# Altium schematic sheet 5V_Power_Supply.SchDoc
size B; Author: AM; CompanyName: Expatria Technologies; DrawnBy: A.Marles; Engineer: AM; Organization: Expatria Technologies; DocumentNumber: 4; Revision: A1; SheetNumber: 4; SheetTotal: 14; PCB_Rev: A1
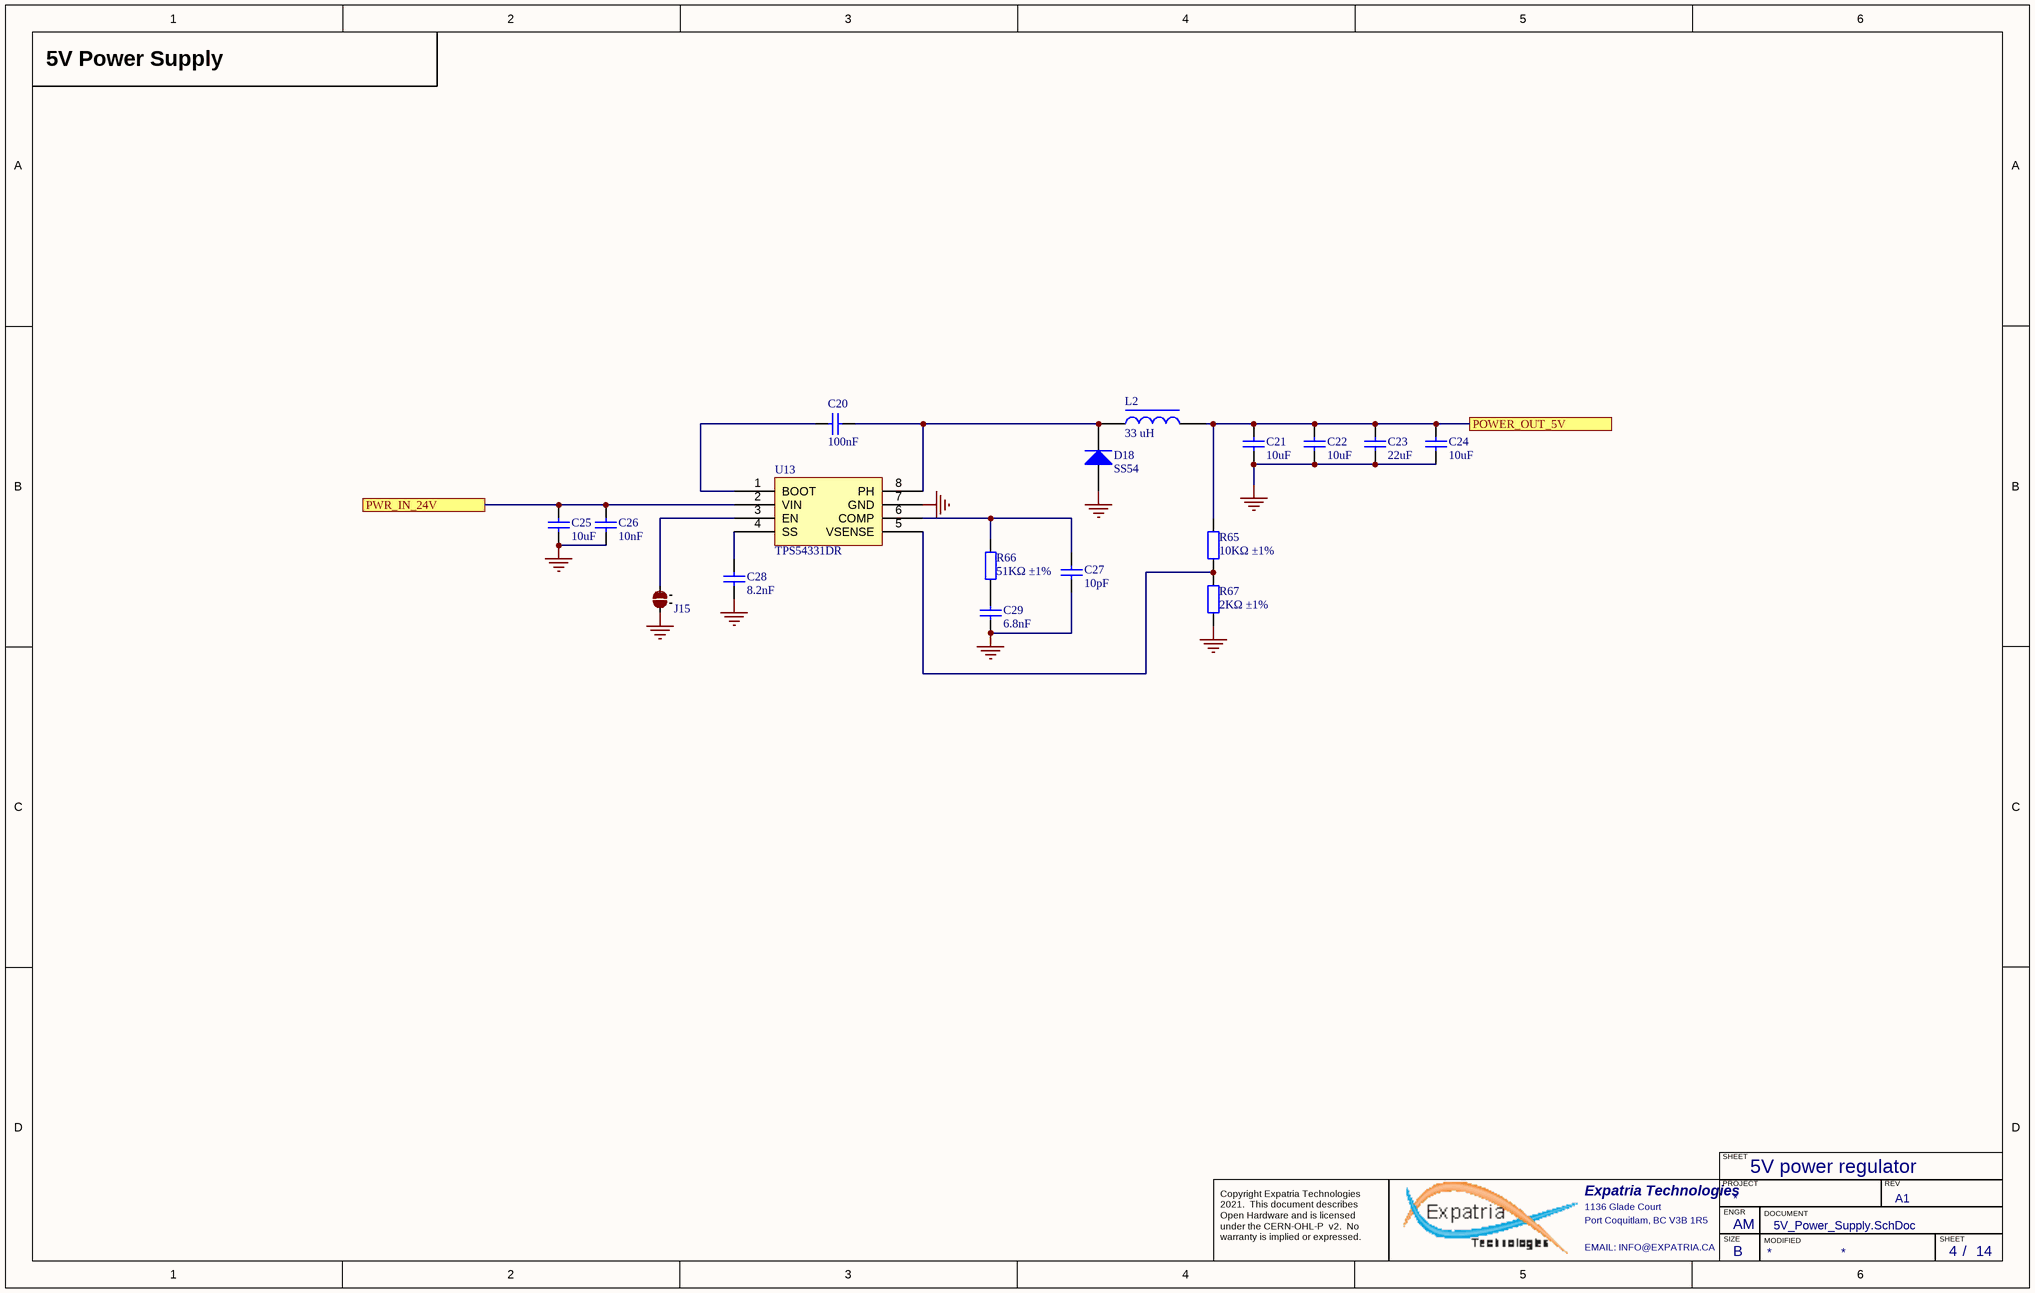
[diagram p0: 5V_Power_Supply.SchDoc]

## Parts
C20  100nF  [0603_C]
C21  10uF  [0603_C]
C22  10uF  [0603_C]
C23  22uF  [0805_C]
C24  10uF  [0603_C]
C25  10uF  [1206_C]
C26  10nF  [0402_C]
C27  10pF  [0402_C]
C28  8.2nF  [0603_C]
C29  6.8nF  [0402_C]
D18  SS54  [SMA(DO-214AC)_S1]
J15  2 way net solder junction - Normally Open  [2waySolder_NO]  (value not drawn)  (no BOM)
L2  33 uH  [INDPM7366X300N]
R65  10KΩ ±1%  [0402_R]
R66  51KΩ ±1%  [0402_R]
R67  2KΩ ±1%  [0402_R]
U13  TPS54331DR  [SOIC-8_150mil]

## Ports
POWER_OUT_5V, PWR_IN_24V

## Nets
GND: C21.1 C22.1 C23.1 C24.1 C25.1 C26.1 C27.1 C28.1 C29.1 D18.1(A) J15.1 R67.1 U13.7(GND)
POWER_OUT_5V: C21.2 C22.2 C23.2 C24.2 L2.2 R65.2 ; port POWER_OUT_5V
PWR_IN_24V: C25.2 C26.2 U13.2(VIN) ; port PWR_IN_24V
NetC20_1: C20.1 U13.1(BOOT)
NetC20_2: C20.2 D18.2(K) L2.1 U13.8(PH)
NetC27_2: C27.2 R66.2 U13.6(COMP)
NetC28_2: C28.2 U13.4(SS)
NetC29_2: C29.2 R66.1
NetJ15_2: J15.2 U13.3(EN)
NetR65_1: R65.1 R67.2 U13.5(VSENSE)

## Notes on the sheet
- 5V Power Supply
- 5V power regulator
- SHEET
- Expatria Technologies
- 1136 Glade Court
- Port Coquitlam, BC V3B 1R5
- PROJECT
- SIZE
- ENGR
- MODIFIED
- DOCUMENT
- REV
- Copyright Expatria Technologies 2021.  This document describes Open Hardware and is licensed under the CERN-OHL-P  v2.  No warranty is implied or expressed.
- EMAIL: INFO@EXPATRIA.CA
- B
- /

## Library data of the parts
C20 = 0603 100nF (104) 10% 50V: Chip capacitors; Manufacturer: YAGEO; PartNumber: CC0603KRX7R9BB104; Tolerance: 10%; Voltage: 50V; Package: 0603; Supplier: LC; SuppliersPartNumber: C14663; Capacitance: 100nF
C21 C22 C24 = 0603 10uF (106) 10% 10V: Chip capacitors; Manufacturer: Samsung Electro-Mechanics; PartNumber: CL10A106KP8NNNC; Tolerance: 10%; Voltage: 10V; Package: 0603; Supplier: LC; SuppliersPartNumber: C19702; Capacitance: 10uF
C23 = 0805 22uF (226) 20% 25V: Chip capacitors; Manufacturer: Samsung Electro-Mechanics; PartNumber: CL21A226MAQNNNE; Tolerance: 20%; Voltage: 25V; Package: 0805; Supplier: LC; SuppliersPartNumber: C45783; Capacitance: 22uF
C25 = 1206 10uF (106) 10% 50V: Chip capacitors; Manufacturer: Samsung Electro-Mechanics; PartNumber: CL31A106KBHNNNE; Tolerance: 10%; Voltage: 50V; Package: 1206; Supplier: LC; SuppliersPartNumber: C13585; Capacitance: 10uF
C26 = 0402 10nF (103) 10% 50V: Chip capacitors; Manufacturer: Samsung Electro-Mechanics; PartNumber: CL05B103KB5NNNC; Tolerance: 10%; Voltage: 50V; Package: 0402; Supplier: LC; SuppliersPartNumber: C15195; Capacitance: 10nF
C27 = 0402 10pF (100) 5% 50V: Chip capacitors; Manufacturer: Samsung Electro-Mechanics; PartNumber: CL05C100JB5NNNC; Tolerance: 5%; Voltage: 50V; Package: 0402; Supplier: LC; SuppliersPartNumber: C32949; Capacitance: 10pF
C28 = 0603 8.2nF (822) 10% 50V: Chip capacitors; Manufacturer: Samsung Electro-Mechanics; PartNumber: CL10B822KB8NNNC; Tolerance: 10%; Voltage: 50V; Package: 0603; Supplier: LC; SuppliersPartNumber: C27920; Capacitance: 8.2nF
C29 = 0402 6.8nF (682) 10% 50V: Chip capacitors; Manufacturer: Guangdong Fenghua Advanced Tech; PartNumber: 0402B682K500NT; Tolerance: 10%; Voltage: 50V; Package: 0402; Supplier: LC; SuppliersPartNumber: C1542; Capacitance: 6.8nF
D18 = SMA(DO-214AC) SS54: 二极管; Package: SMA(DO-214AC); Supplier: LC; SuppliersPartNumber: C22452
J15 = 2waySolderNO
L2 = 1206 10uH 10%: 33uH ±20% 2A 270mΩ SMD,6.6x7.3x3.0mm Power Inductors RoHS; Package: SMD_6.6x7.3x3.0mm; Supplier: JLCPCB; SuppliersPartNumber: C329385
R65 = 0402 10K (1002) 1%: Chip resistor; Manufacturer: Uniroyal Elec; PartNumber: 0402WGF1002TCE; Power: 1/16W; Package: 0402; Supplier: LC; SuppliersPartNumber: C25744; Resistance: 10KΩ; Tolerance: 1%
R66 = 0402 51K (5102) 1%: Chip resistor; Manufacturer: Uniroyal Elec; PartNumber: 0402WGF5102TCE; Power: 1/16W; Package: 0402; Supplier: LC; SuppliersPartNumber: C25794; Resistance: 51KΩ; Tolerance: 1%
R67 = 0402 2K (2001) 1%: Chip resistor; Manufacturer: Uniroyal Elec; PartNumber: 0402WGF2001TCE; Power: 1/16W; Package: 0402; Supplier: LC; SuppliersPartNumber: C4109; Resistance: 2KΩ; Tolerance: 1%
U13 = TPS54331DR_[C9865]: DC-DC芯片; Package: SOIC-8_150mil; Supplier: LC; SuppliersPartNumber: C9865